# EAGLE design MicroMod_SAMD51 (EAGLE 9.5.2)
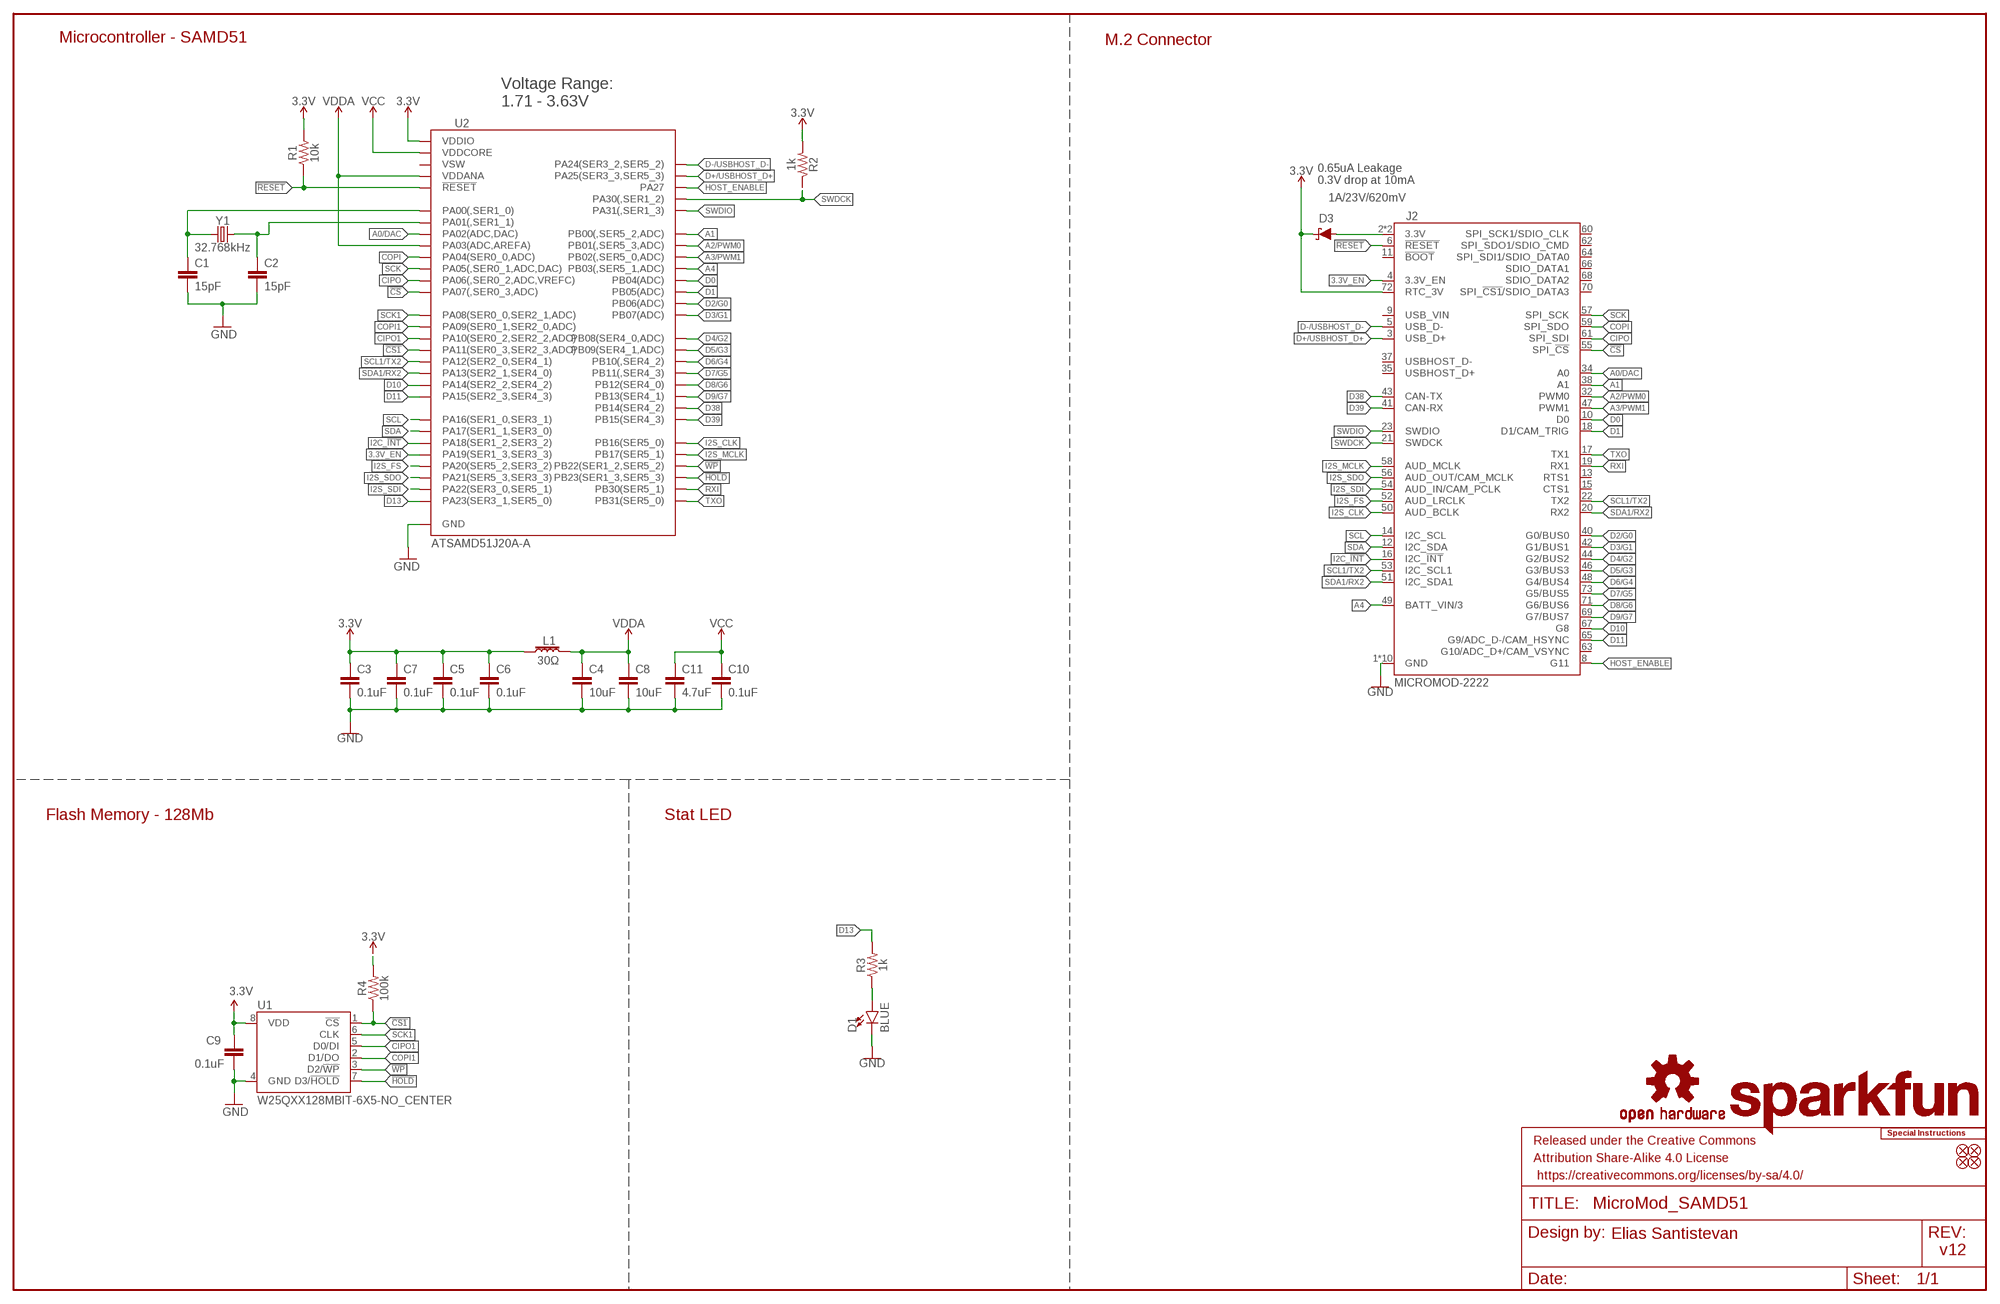
[diagram p0: schematic, sheet 1]

## Parts
C1  15pF  15PF-0402T-50V-5%  [0402-TIGHT]
C2  15pF  15PF-0402T-50V-5%  [0402-TIGHT]
C3  0.1uF  0.1UF-0402T-10V-10%-X7R  [0402-TIGHT]
C4  10uF  10UF-0402T-6.3V-20%  [0402-TIGHT]
C5  0.1uF  0.1UF-0402T-10V-10%-X7R  [0402-TIGHT]
C6  0.1uF  0.1UF-0402T-10V-10%-X7R  [0402-TIGHT]
C7  0.1uF  0.1UF-0402T-10V-10%-X7R  [0402-TIGHT]
C8  10uF  10UF-0402T-6.3V-20%  [0402-TIGHT]
C9  0.1uF  0.1UF-0402T-10V-10%-X7R  [0402-TIGHT]
C10  0.1uF  0.1UF-0402T-10V-10%-X7R  [0402-TIGHT]
C11  4.7uF  4.7UF-0402_TIGHT-6.3V-20%-X5R  [0402-TIGHT]
D1  BLUE  LED-BLUE0603  [LED-0603]
D3  1A/23V/620mV  DIODE-SCHOTTKY-BAT20J  [SOD-323]
FD5  FIDUCIALUFIDUCIAL  [FIDUCIAL-MICRO]
FD6  FIDUCIALUFIDUCIAL  [FIDUCIAL-MICRO]
FD7  FIDUCIALUFIDUCIAL  [FIDUCIAL-MICRO]
FD8  FIDUCIALUFIDUCIAL  [FIDUCIAL-MICRO]
FRAME2  FRAME-LEDGER  [CREATIVE_COMMONS]
J2  MICROMOD-2222  [M.2-CARD-E-22]
L1  30Ω  FERRITE_BEAD-0402-30OHM-100MHZ  [0402-TIGHT]
LOGO2  OSHW-LOGOMINI  [OSHW-LOGO-MINI]
LOGO5  SPECIAL_INSTRUCTIONS-ORDERING  [ORDERING_INSTRUCTIONS]
LOGO6  SFE_LOGO_NAME.1_INCH  [SFE_LOGO_NAME_.1]
R1  10k  10KOHM-0402T-1/16W-1%  [0402-TIGHT]
R2  1k  1KOHM-0402T-1/16W-1%  [0402-TIGHT]
R3  1k  1KOHM-0402T-1/16W-1%  [0402-TIGHT]
R4  100k  100KOHM-0402T-1/16W-1%  [0402-TIGHT]
U1  W25QXX128MBIT-6X5-NO_CENTER  [WSON-8-6X5-NO_CENTERPAD]
U2  ATSAMD51J20A-A  [TQFP64]
Y1  32.768kHz  CRYSTAL-32.768KHZSMD-3.2X1.5  [CRYSTAL-SMD-3.2X1.5MM]

## Nets
3.3V: C3.1 C5.1 C6.1 C7.1 C9.1 D3.C J2.72(RTC_3V) L1.1 R1.2 R2.2 R4.2 U1.8(VDD) U2.21(VDDIO) U2.34(VDDIO) U2.48(VDDIO) U2.56(VDDIO)
3.3V_EN: J2.4(3.3V_EN) U2.38(PA19(SER1_3,SER3_3))
3.3V_IN: D3.A J2.2(3.3V) J2.74(3.3V)
!CS: J2.55(SPI_!CS!) U2.16(PA07(,SER0_3,ADC))
!CS1!: R4.1 U1.1(!CS!) U2.20(PA11(SER0_3,SER2_3,ADC))
!HOLD!: U1.7(D3/!HOLD!) U2.50(PB23(SER1_3,SER5_3))
!RESET: J2.6(!RESET!) R1.1 U2.52(!RESET)
!WP!: U1.3(D2/!WP!) U2.49(PB22(SER1_2,SER5_2))
A0/DAC: J2.34(A0) U2.3(PA02(ADC,DAC))
A1: J2.38(A1) U2.61(PB00(,SER5_2,ADC))
A2/PWM0: J2.32(PWM0) U2.62(PB01(,SER5_3,ADC))
A3/PWM1: J2.47(PWM1) U2.63(PB02(,SER5_0,ADC))
A4: J2.49(BATT_VIN/3) U2.64(PB03(,SER5_1,ADC))
CIPO: J2.61(SPI_SDI) U2.15(PA06(,SER0_2,ADC,VREFC))
CIPO1: U1.5(D0/DI) U2.19(PA10(SER0_2,SER2_2,ADC))
COPI: J2.59(SPI_SDO) U2.13(PA04(SER0_0,ADC))
COPI1: U1.2(D1/DO) U2.18(PA09(SER0_1,SER2_0,ADC))
D0: J2.10(D0) U2.5(PB04(ADC))
D1: J2.18(D1/CAM_TRIG) U2.6(PB05(ADC))
D2/G0: J2.40(G0/BUS0) U2.9(PB06(ADC))
D3/G1: J2.42(G1/BUS1) U2.10(PB07(ADC))
D4/G2: J2.44(G2/BUS2) U2.11(PB08(SER4_0,ADC))
D5/G3: J2.46(G3/BUS3) U2.12(PB09(SER4_1,ADC))
D6/G4: J2.48(G4/BUS4) U2.23(PB10(,SER4_2))
D7/G5: J2.73(G5/BUS5) U2.24(PB11(,SER4_3))
D8/G6: J2.71(G6/BUS6) U2.25(PB12(SER4_0))
D9/G7: J2.69(G7/BUS7) U2.26(PB13(SER4_1))
D10: J2.67(G8) U2.31(PA14(SER2_2,SER4_2))
D11: J2.65(G9/ADC_D-/CAM_HSYNC) U2.32(PA15(SER2_3,SER4_3))
D13: R3.2 U2.44(PA23(SER3_1,SER5_0))
D38: J2.43(CAN-TX) U2.27(PB14(SER4_2))
D39: J2.41(CAN-RX) U2.28(PB15(SER4_3))
D+/USBHOST_D+ [USB]: J2.3(USB_D+) U2.46(PA25(SER3_3,SER5_3))
D-/USBHOST_D- [USB]: J2.5(USB_D-) U2.45(PA24(SER3_2,SER5_2))
GND: C1.2 C2.2 C3.2 C4.2 C5.2 C6.2 C7.2 C8.2 C9.2 C10.2 C11.2 D1.C J2.1(GND) J2.7(GND) J2.33(GND) J2.36(GND) J2.39(GND) J2.45(GND) J2.75(GND) J2.GND1(GND) J2.GND2(GND) J2.GND3(GND) U1.4(GND) U2.7(GND) U2.22(GND) U2.33(GND) U2.47(GND) U2.54(GND)
HOST_ENABLE: J2.8(G11) U2.51(PA27)
I2C_!INT!: J2.16(I2C_!INT!) U2.37(PA18(SER1_2,SER3_2))
I2S_CLK: J2.50(AUD_BCLK) U2.39(PB16(SER5_0))
I2S_FS: J2.52(AUD_LRCLK) U2.41(PA20(SER5_2,SER3_2))
I2S_MCLK: J2.58(AUD_MCLK) U2.40(PB17(SER5_1))
I2S_SDI: J2.54(AUD_IN/CAM_PCLK) U2.43(PA22(SER3_0,SER5_1))
I2S_SDO: J2.56(AUD_OUT/CAM_MCLK) U2.42(PA21(SER5_3,SER3_3))
N$1: D1.A R3.1
RXI: J2.19(RX1) U2.59(PB30(SER5_1))
SCK [Clock Signals]: J2.57(SPI_SCK) U2.14(PA05(,SER0_1,ADC,DAC))
SCK1 [Clock Signals]: U1.6(CLK) U2.17(PA08(SER0_0,SER2_1,ADC))
SCL: J2.14(I2C_SCL) U2.35(PA16(SER1_0,SER3_1))
SCL1/TX2: J2.22(TX2) J2.53(I2C_SCL1) U2.29(PA12(SER2_0,SER4_1))
SDA: J2.12(I2C_SDA) U2.36(PA17(SER1_1,SER3_0))
SDA1/RX2: J2.20(RX2) J2.51(I2C_SDA1) U2.30(PA13(SER2_1,SER4_0))
SWDCK: J2.21(SWDCK) R2.1 U2.57(PA30(,SER1_2))
SWDIO: J2.23(SWDIO) U2.58(PA31(,SER1_3))
TXO: J2.17(TX1) U2.60(PB31(SER5_0))
VCC: C10.1 C11.1 U2.53(VDDCORE)
VDDA: C4.1 C8.1 L1.2 U2.4(PA03(ADC,AREFA)) U2.8(VDDANA)
XIN32: C1.1 U2.1(PA00(,SER1_0)) Y1.P$1
XOUT32: C2.1 U2.2(PA01(,SER1_1)) Y1.P$2
Unconnected: J2.9(USB_VIN) J2.11(!BOOT!) J2.13(RTS1) J2.15(CTS1) J2.35(USBHOST_D+) J2.37(USBHOST_D-) J2.60(SPI_SCK1/SDIO_CLK) J2.62(SPI_SDO1/SDIO_CMD) J2.63(G10/ADC_D+/CAM_VSYNC) J2.64(SPI_SDI1/SDIO_DATA0) J2.66(SDIO_DATA1) J2.68(SDIO_DATA2) J2.70(SPI_!CS1!/SDIO_DATA3) U2.55(VSW)

## Notes on the sheet
- Microcontroller - SAMD51 | M.2 Connector
- Voltage Range:
  1.71 - 3.63V
- 0.65uA Leakage
  0.3V drop at 10mA
- Flash Memory - 128Mb | Stat LED
- Elias Santistevan
- v12

## Library data of the parts
C1 C2 = SparkFun-Capacitors:15PF: 15pF ceramic capacitors A capacitor is a passive two-terminal electrical component used to store electrical energy temporarily in an electric field.; PROD_ID: CAP-13063
C3 C5-C7 C9 C10 = SparkFun-Capacitors:0.1UF: 0.1µF ceramic capacitors A capacitor is a passive two-terminal electrical component used to store electrical energy temporarily in an electric field.; PROD_ID: CAP-15083
C4 C8 = SparkFun-Capacitors:10UF: 10.0µF ceramic capacitors A capacitor is a passive two-terminal electrical component used to store electrical energy temporarily in an electric field.; PROD_ID: CAP-14848
C11 = SparkFun-Capacitors:4.7UF: 4.7µF ceramic capacitors A capacitor is a passive two-terminal electrical component used to store electrical energy temporarily in an electric field.; PROD_ID: CAP-14240
D1 = SparkFun-LED:LED-BLUE: Blue SMD LED Used in manufacturing of various products at SparkFun Packages: 0603 - SMD 0603 package [Product Link] <http://www.digikey.com/product-detail/en/SMLE12BC7TT86/511-1589-2-ND/1641808> 1206 - SMD1206 package [Product Link] <http://www.digikey.com/product-detail/en/lite-on-inc/LTST-C150TBKT/160-1643-1-ND/573584> SparkFun Products: ESP8266 Thing-Dev Board <https://www.sparkfun.com/products/13711> RedBoard <https://www.sparkfun.com/products/12757>; PROD_ID: DIO-08575
D3 = SparkFun-DiscreteSemi:DIODE-SCHOTTKY: Schottky diode A Schottky diode is a semiconductor diode which has a low forward voltage drop and a very fast switching action.; PROD_ID: DIO-11623
FD5-FD8 = SparkFun-Aesthetics:FIDUCIAL: Fiducial Alignment Points Point-of-reference for pick-and-place machines and other optical instruments.
FRAME2 = SparkFun-Aesthetics:FRAME-LEDGER: Schematic Frame - Ledger Standard 11x14 US Ledger frame
J2 = SparkFun-MicroMod:MICROMOD: MicroMod Connector Description: A card edge connector and mating PCB connector to allow various MicroMod Processor Boards to be coupled with various carrier boards of different capabilities. Based on the M.2 standard.
L1 = SparkFun-Coils:FERRITE_BEAD: Ferrite Bead (blocks, cores, rings, chokes, etc.) Inductor with layers of ferrite used to suppress high frequencies. Often used to isolate high frequency noise. SparkFun Products: IOIO-OTG - V2.2 <https://www.sparkfun.com/products/13613> SparkFun SAMD21 Mini Breakout <https://www.sparkfun.com/products/13664> SparkFun 6 Degrees of Freedom Breakout - LSM6DS3 <https://www.sparkfun.com/products/13339> SparkFun SAMD21 Dev Breakout <https://www.sparkfun.com/products/13672>; PROD_ID: NDUC-15133
LOGO2 = SparkFun-Aesthetics:OSHW-LOGO: Open-Source Hardware (OSHW) Logo This logo indicates the piece of hardware it is found on incorporates a OSHW license and/or adheres to the definition of open source hardware found here: http://freedomdefined.org/OSHW
LOGO5 = SparkFun-Aesthetics:SPECIAL_INSTRUCTIONS: Special Ordering/Production Instructions Alert Symbol for special PCB ordering instructions or unique production process warnings. Ordering Instructions Production Instructions Types of information that should be added to box: Copper weight Soldermask color Silk color PCB thickness Number of layers PCB Standard: 1.6mm FR4 1 oz copper immersion silver plating red soldermask white silkscreen Types of information that should be added to box: Special wash requirements Depaneling instructions Humidification Glue curing Default text settings: 0.07 inch 9% ratio 50% line distance
LOGO6 = SparkFun-Aesthetics:SFE_LOGO_NAME: SparkFun Font Logo This is the SparkFun name logo. The logo on the schematic will always be the same size; the package variant is the height of the flame part of the logo (or the height the flame would be, if it were drawn). Default layer for the logo on the board is tSilk.
R1 = SparkFun-Resistors:10KOHM: 10kΩ resistor A resistor is a passive two-terminal electrical component that implements electrical resistance as a circuit element. Resistors act to reduce current flow, and, at the same time, act to lower voltage levels within circuits. - Wikipedia; PROD_ID: RES-14241
R2 R3 = SparkFun-Resistors:1KOHM: 1kΩ resistor A resistor is a passive two-terminal electrical component that implements electrical resistance as a circuit element. Resistors act to reduce current flow, and, at the same time, act to lower voltage levels within circuits. - Wikipedia; PROD_ID: RES-14342
R4 = SparkFun-Resistors:100KOHM: 100kΩ resistor A resistor is a passive two-terminal electrical component that implements electrical resistance as a circuit element. Resistors act to reduce current flow, and, at the same time, act to lower voltage levels within circuits. - Wikipedia; PROD_ID: RES-13495
U1 = SparkFun-MicroMod:W25QXX; PROD_ID: IC-15107
U2 = SparkFun-IC-Microcontroller:ATSAMD51J20A-A; PROD_ID: IC-13952
Y1 = SparkFun-Clocks:CRYSTAL-32.768KHZ: 32.768kHz Crystal Frequency: 32.768kHz Frequency Stability: ±20ppm Load Capacitance: 12.5pF (PTH-2X6 & SMD-3.2X1.5), 6pF (SMD-2X6) SparkFun Products: SparkFun BigTime Watch Kit <https://www.sparkfun.com/products/11734> SparkFun nRF52832 Breakout <https://www.sparkfun.com/products/13990> SparkFun Real Time Clock Module <https://www.sparkfun.com/products/12708>; PROD_ID: XTAL-13062

## Net classes
0 default: width 0 mm, drill 0 mm
1 Clock Signals: clearance 0.203 mm
2 USB: width 0.102 mm, clearance 0.076 mm

## Board
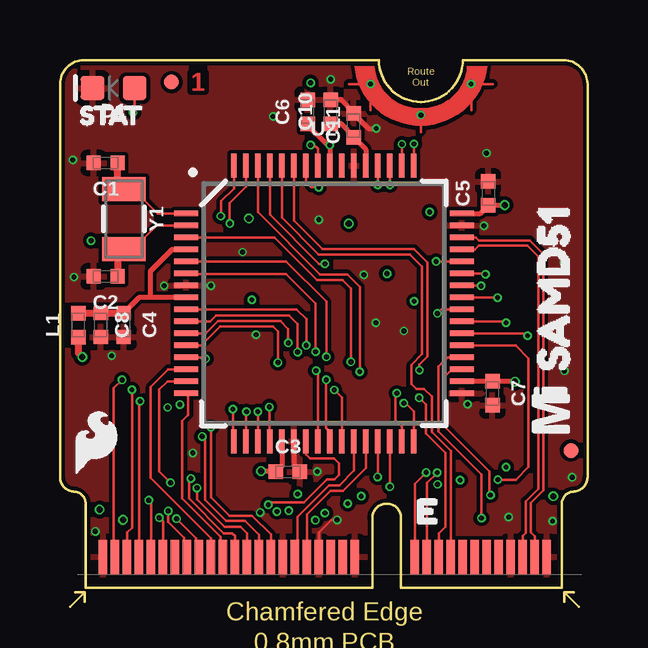
[diagram p1: board, top side]
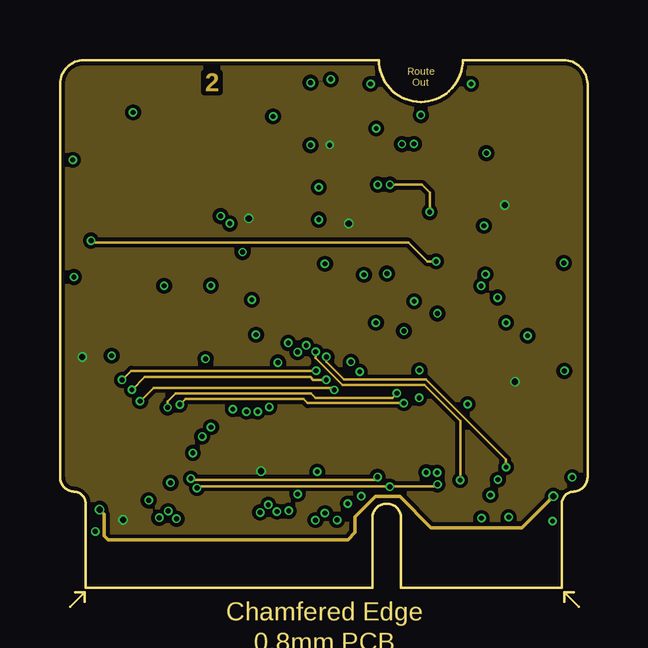
[diagram p2: board, inner layer PWR_HORIZ]
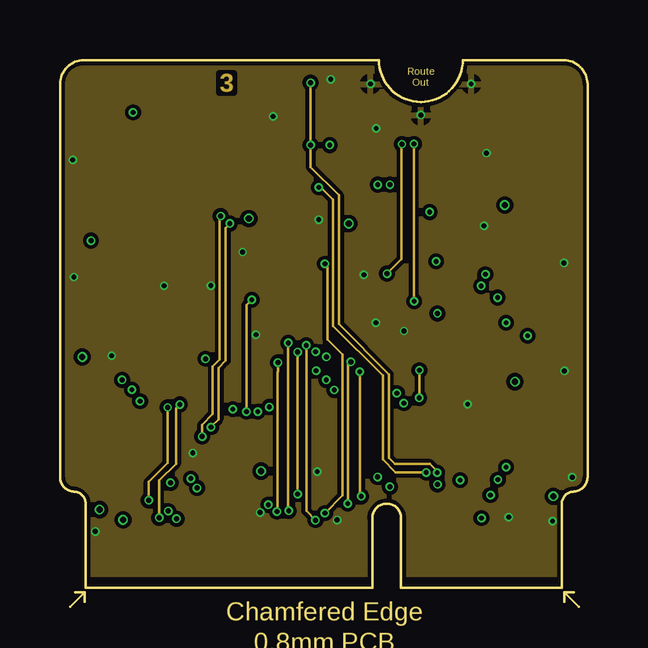
[diagram p3: board, inner layer GND-VERT]
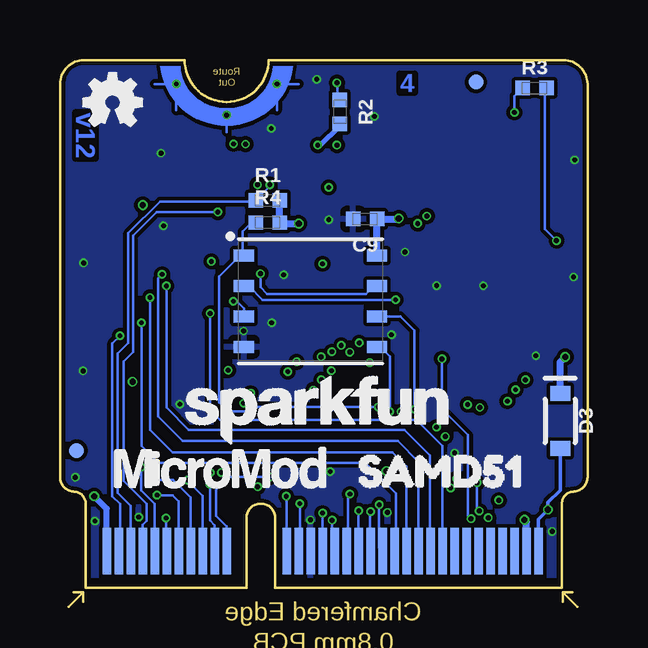
[diagram p4: board, bottom side, seen from below]

Size 22 x 22 mm. Coordinates in mm from the lower left corner, seen from the top.
Outline: 0,4.6 0,21 arc-87 1,22 13.3,22 arc90 15.05,20.25 arc90 16.8,22 21,22 arc-87 22,21 22,4.6
Outline: 0,4.6 arc87 0.6,4
Outline: 21.4,4 arc87 22,4.6
Outline: 21.4,4 arc85 20.93,3.5 20.93,0 14.22,0 14.22,2.9 arc180 13.03,2.9 13.03,0 1.07,0 1.07,3.5 arc84 0.6,4
Outline: 21.4,4 arc87 22,4.6
Outline: 0,4.6 arc87 0.6,4
Copper layers (1+2*15+16): Top 0.035mm / dielectric 1.5mm / PWR_HORIZ 0.035mm / dielectric 0.15mm / GND-VERT 0.035mm / dielectric 0.2mm / Bottom 0.035mm
Design rules "SparkFun-4-layer-MicroMod": minimum track width 4mil, minimum drill 0.2mm, track to track 4mil, track to pad 4mil, pad to pad 4mil, via to via 4mil, smd to smd 4mil, copper to edge 6mil, drill to drill 6mil, minimum pad ring 3mil, minimum via ring 3mil, stop-mask expansion 4mil, vias tented up to drill 25mil, thermal gap 10mil

### Footprints (pad centres in the part's own frame; a part is rotated, then mirrored left to right if it is on the bottom)
0402-TIGHT = smd 0.6 x 0.6: 1 -0.5,0; 2 0.5,0
LED-0603 = smd 1 x 1: A -0.877,0; C 0.877,0
SOD-323 = smd 0.63 x 0.83: A 1.15,0; C -1.15,0
FIDUCIAL-MICRO = smd 0.635 x 0.635: 1 0,0
M.2-CARD-E-22 = smd 0.35 x 1.45: 1 9.25,1.275; 3 8.75,1.275; 5 8.25,1.275; 7 7.75,1.275; 9 7.25,1.275; 11 6.75,1.275; 13 6.25,1.275; 15 5.75,1.275; 17 5.25,1.275; 19 4.75,1.275; 21 4.25,1.275; 23 3.75,1.275; 33 1.25,1.275; 35 0.75,1.275; 37 0.25,1.275; 39 -0.25,1.275; 41 -0.75,1.275; 43 -1.25,1.275; 45 -1.75,1.275; 47 -2.25,1.275; 49 -2.75,1.275; 51 -3.25,1.275; 53 -3.75,1.275; 55 -4.25,1.275; 57 -4.75,1.275; 59 -5.25,1.275; 61 -5.75,1.275; 63 -6.25,1.275; 65 -6.75,1.275; 67 -7.25,1.275; 69 -7.75,1.275; 71 -8.25,1.275; 73 -8.75,1.275; 75 -9.25,1.275 | smd 0.35 x 1.95 bottom: 2 9,1.525; 4 8.5,1.525; 6 8,1.525; 8 7.5,1.525; 10 7,1.525; 12 6.5,1.525; 14 6,1.525; 16 5.5,1.525; 18 5,1.525; 20 4.5,1.525; 22 4,1.525; 32 1.5,1.525; 34 1,1.525; 36 0.5,1.525; 38 0,1.525; 40 -0.5,1.525; 42 -1,1.525; 44 -1.5,1.525; 46 -2,1.525; 48 -2.5,1.525; 50 -3,1.525; 52 -3.5,1.525; 54 -4,1.525; 56 -4.5,1.525; 58 -5,1.525; 60 -5.5,1.525; 62 -6,1.525; 64 -6.5,1.525; 66 -7,1.525; 68 -7.5,1.525; 70 -8,1.525; 72 -8.5,1.525; 74 -9,1.525 | drill 0.2: GND1 1.9,21; GND2 4,19.7; GND3 6.1,21
WSON-8-6X5-NO_CENTERPAD = smd 0.85 x 0.5: 1 -2.775,1.905; 2 -2.775,0.635; 3 -2.775,-0.635; 4 -2.775,-1.905; 5 2.775,-1.905; 6 2.775,-0.635; 7 2.775,0.635; 8 2.775,1.905
TQFP64 = smd 0.22 x 1: 1 -3.75,-5.75; 2 -3.25,-5.75; 3 -2.75,-5.75; 4 -2.25,-5.75; 5 -1.75,-5.75; 6 -1.25,-5.75; 7 -0.75,-5.75; 8 -0.25,-5.75; 9 0.25,-5.75; 10 0.75,-5.75; 11 1.25,-5.75; 12 1.75,-5.75; 13 2.25,-5.75; 14 2.75,-5.75; 15 3.25,-5.75; 16 3.75,-5.75; 33 3.75,5.75; 34 3.25,5.75; 35 2.75,5.75; 36 2.25,5.75; 37 1.75,5.75; 38 1.25,5.75; 39 0.75,5.75; 40 0.25,5.75; 41 -0.25,5.75; 42 -0.75,5.75; 43 -1.25,5.75; 44 -1.75,5.75; 45 -2.25,5.75; 46 -2.75,5.75; 47 -3.25,5.75; 48 -3.75,5.75 | smd 1 x 0.22: 17 5.75,-3.75; 18 5.75,-3.25; 19 5.75,-2.75; 20 5.75,-2.25; 21 5.75,-1.75; 22 5.75,-1.25; 23 5.75,-0.75; 24 5.75,-0.25; 25 5.75,0.25; 26 5.75,0.75; 27 5.75,1.25; 28 5.75,1.75; 29 5.75,2.25; 30 5.75,2.75; 31 5.75,3.25; 32 5.75,3.75; 49 -5.75,3.75; 50 -5.75,3.25; 51 -5.75,2.75; 52 -5.75,2.25; 53 -5.75,1.75; 54 -5.75,1.25; 55 -5.75,0.75; 56 -5.75,0.25; 57 -5.75,-0.25; 58 -5.75,-0.75; 59 -5.75,-1.25; 60 -5.75,-1.75; 61 -5.75,-2.25; 62 -5.75,-2.75; 63 -5.75,-3.25; 64 -5.75,-3.75
CRYSTAL-SMD-3.2X1.5MM = smd 1 x 1.8: P$1 -1.25,0; P$2 1.25,0

### Placement (x,y rotation side)
C1  1.91,17.71 180 top
C2  1.91,12.98 180 top
C3  9.51,4.83 0 top
C4  2.66,10.95 270 top
C5  17.86,16.43 90 top
C6  10.33,19.84 90 top
C7  18.04,8.1 270 top
C8  1.71,10.95 270 top
C9  9.27,15.37 180 bottom
C10  11.28,19.84 90 top
C11  12.25,19.27 90 top
D1  2.24,20.83 180 top
D3  1.14,6.95 270 bottom
FD5  4.65,21.08 0 top
FD6  4.65,21.08 0 bottom
FD7  21.31,5.71 0 bottom
FD8  21.31,5.71 0 top
FRAME2  -7.62,-13.97 0 top  (outside the outline)
J2  11.05,0 0 top
L1  0.77,10.94 90 top
LOGO2  19.8,20.24 0 bottom
LOGO5  30.48,50.8 0 top  (outside the outline)
LOGO6  11.26,7.4 0 bottom
R1  13.34,16.14 0 bottom
R2  10.33,19.84 270 bottom
R3  2.21,20.83 0 bottom
R4  13.34,15.22 0 bottom
U1  11.56,11.94 0 bottom
U2  11,11.85 270 top
U$1  [MICROMOD_MI_LOGO_.35]  20.45,7.37 90 top
U$4  [MICROMOD_LOGO_.35]  15.37,4.95 0 bottom
U$5  [SAMD510]  10.72,4.86 0 bottom
U$6  [SAMD510]  20.57,7.87 90 top
U$7  [SFE_LOGO_FLAME_.1]  1.5,6.07 0 top
U$8  [STAT0]  0.13,19.68 0 top
Y1  2.67,15.37 270 top

### Tracks (layer width: path | path; a pad name or v marks a point on that pad's centre or on a via)
3.3V  (via drill 0.2, 0.25)
  Top 0.203: v18.98,8.58 18.96,8.6 C7.1 U2.34 | U2.21 9.25,5.07 C3.1 8.98,4.85 v8.39,4.85 | v18.55,15.95 18.53,15.93 C5.1 17.52,15.6 U2.48 | U2.56 v11.25,18.45 11.23,18.47 11.13,18.47 10.33,19.27 R2.2
  Top 0.3: L1.1 0.77,9.78 v0.94,9.61
  Bottom 0.203: R2.2 10.33,19.27 11.15,18.45 v11.25,18.45
  Bottom 0.3: U1.8 8.78,15.36 C9.1 7.9,15.37 v7.87,15.39 | R1.2 R4.2 12.8,15.18 v12.04,15.18 | J2.72 2.55,2.74 v2.63,2.82 | D3.C 1.14,9.4 v0.94,9.61
  pour PWR_HORIZ (isolate 0.152): -0.01,20.85 arc-90 1.12,21.97 21.06,21.97 arc-90 22,21.03 22,0.56 0.04,0.56 0.04,4.19
3.3V_EN  (via drill 0.2)
  Top 0.102: v19.5,10.5 19.4,10.6 U2.38
  Bottom 0.102: J2.4 19.5,1.57 19.5,3.48 19.82,3.8 19.82,10.18 v19.5,10.5
3.3V_IN  (via drill 0.25)
  PWR_HORIZ 0.15: v1.65,3.25 1.85,3.05 1.85,2.15 2,2 12,2 12.3,2.3 12.3,2.95 13.15,3.8 14.17,3.8 15.48,2.49 19.25,2.49 v20.57,3.81
  Bottom 0.15: J2.74 2.05,2.85 v1.65,3.25 1.65,3.55 1.14,4.06 D3.A
  Bottom 0.254: J2.2 20.05,3.29 v20.57,3.81
!CS
  Top 0.102: U2.16 5.35,8.1 5.35,7.2 5.33,7.18 5.09,6.94 5.09,3.71 6.69,2.11 6.69,1.39 J2.55
!CS1!  (via drill 0.2)
  Top 0.102: v8.73,7.53 8.73,6.12 U2.20
  Bottom 0.102: U1.1 14.49,13.84 15.36,12.97 15.36,7.72 14.99,7.35 13.96,7.35 13.78,7.53 v8.73,7.53
  Bottom 0.114: U1.1 14.38,13.89 14.38,14.85 14.02,15.22 R4.1
!HOLD!  (via drill 0.2)
  Top 0.102: U2.50 v14.25,18.48 v14.26,18.49
  GND-VERT 0.102: v13.64,13.09 14.24,13.69 14.24,18.47 v14.26,18.49
  Bottom 0.102: U1.7 8.93,12.57 9.25,12.25 13.36,12.25 13.64,12.53 v13.64,13.09
!RESET  (via drill 0.2)
  Top 0.102: U2.52 v13.25,16.8
  Bottom 0.102: J2.6 19.05,3.41 19.59,3.95 19.59,9.75 19.15,10.19 19.15,14.77 17.83,16.09 13.88,16.09 R1.1 13.84,16.16 13.25,16.75 v13.25,16.8
!WP!  (via drill 0.2)
  Top 0.102: U2.49 v14.75,18.49 v14.76,18.5
  GND-VERT 0.102: v14.76,18.5 v14.77,18.49 v14.77,11.94
  Bottom 0.102: U1.3 14.33,11.64 14.63,11.94 v14.77,11.94
A0/DAC  (via drill 0.2)
  Top 0.102: U2.3 8.95,14.59 10.72,12.82 11.78,12.82 12.13,12.47 v12.13,9.41
  GND-VERT 0.102: v12.13,9.41 12,9.28 v12,3.5
  Bottom 0.102: J2.34 12,1.57 v12,3.5
A1  (via drill 0.2)
  Top 0.102: U2.61 8.75,15.55 10.8,13.5 v11.05,13.5
  GND-VERT 0.102: v11.05,13.5 11.16,13.39 11.16,10.35 11.79,9.72 11.79,3.84 v11.05,3.1
  Bottom 0.102: J2.38 v11.05,3.1
A2/PWM0  (via drill 0.2)
  Top 0.102: U2.62 8.25,15.65 10.85,13.05 11.99,13.05 12.5,12.54 v12.5,9
  GND-VERT 0.102: v12.5,9 12.5,3.87 v12.56,3.81
  Bottom 0.102: J2.32 12.55,3.74 12.59,3.78 v12.56,3.81
A3/PWM1  (via drill 0.2)
  Top 0.102: v7.08,15.18 7.08,16.04 7.75,16.71 U2.63 | J2.47 8.8,2.21 8.02,2.99 7.08,2.99 6.3,3.77 v6.3,6.69
  GND-VERT 0.102: v7.08,15.18 v7.08,15.17 6.91,15 6.91,9.46 6.61,9.16 6.61,7.02 6.3,6.71 v6.3,6.69
A4  (via drill 0.2)
  Top 0.102: U2.64 7.25,16.64 6.72,16.11 6.72,15.51 v6.7,15.49 | J2.49 8.3,2.2 7.72,2.78 6.92,2.78 6.05,3.65 6.05,6.18 v5.93,6.3
  GND-VERT 0.102: v6.7,15.49 6.66,15.45 6.66,9.51 6.37,9.22 6.37,7.23 5.93,6.79 v5.93,6.3
CIPO  (via drill 0.2)
  Top 0.102: v4.61,4.37 4.14,4.84 4.14,8.25 4.49,8.6 U2.15 | J2.61 5.18,1.4 5.18,2.08 4.51,2.74 v4.51,3.19
  Bottom 0.102: v4.51,3.19 4.61,3.29 v4.61,4.37
CIPO1  (via drill 0.2)
  Top 0.102: U2.19 v8.25,7.33
  Bottom 0.102: v8.25,7.33 8.25,9.64 8.64,10.03 U1.5
COPI  (via drill 0.2)
  Top 0.102: U2.13 6,9.6 v6.07,9.54 | J2.59 5.67,1.41 5.67,2.06 v4.86,2.87
  Bottom 0.102: v6.07,9.54 6.07,7.45 4.98,6.36 4.98,2.99 v4.86,2.87
COPI1  (via drill 0.2)
  Top 0.102: U2.18 7.75,7.3 v7.78,7.33
  GND-VERT 0.102: v7.78,7.33 7.78,11.78 v8,12
  Bottom 0.102: U1.2 14.12,12.57 13.55,12 v8,12
D0  (via drill 0.2)
  Top 0.102: v11.11,9.62 11.11,11.92 9.43,13.6 U2.5
  PWR_HORIZ 0.102: v11.11,9.62 11.11,9.41 11.85,8.67 15.27,8.67 18.6,5.34 v18.6,5.02
  Bottom 0.102: J2.10 18.05,3.48 18.62,4.05 18.62,5 v18.6,5.02
D1  (via drill 0.2)
  Top 0.102: U2.6 5.27,13.08 9.42,13.08 10.66,11.84 v10.66,9.83
  PWR_HORIZ 0.102: v10.66,9.83 10.66,9.57 11.78,8.45 15.19,8.45 16.69,6.95 v16.69,4.48
  Bottom 0.102: J2.18 16.05,3.82 16.69,4.46 v16.69,4.48
D2/G0  (via drill 0.2)
  Top 0.102: U2.9 9.87,11.6 10.27,11.2 v10.27,10.1
  GND-VERT 0.102: v10.27,10.1 10.27,3.19 v10.65,2.81
  Bottom 0.102: v10.65,2.81 10.65,1.63 J2.40
D3/G1  (via drill 0.2)
  Top 0.102: U2.10 6.25,11.1 6.5,11.35 9.55,11.35 9.91,10.99 v9.91,9.82
  GND-VERT 0.102: v9.91,9.82 9.91,3.96 v9.91,3.89
  Bottom 0.102: v9.91,3.89 10,3.8 10,1.57 J2.42
D4/G2  (via drill 0.2)
  Top 0.102: U2.11 6.07,10.6 6.59,11.12 9.19,11.12 9.52,10.79 v9.52,10.2
  GND-VERT 0.102: v9.52,10.2 9.52,3.22 v9.54,3.2
  Bottom 0.102: v9.54,3.2 v9.55,3.19 J2.44
D5/G3  (via drill 0.2)
  Top 0.102: U2.12 5.89,10.1 6.67,10.88 8.89,10.88 9.09,10.68 v9.09,9.38
  GND-VERT 0.102: v9.05,3.17 9.08,3.17 9.08,9 9.09,9.01 v9.09,9.38
  Bottom 0.102: J2.46 9.07,1.55 9.07,3.15 v9.05,3.17
D6/G4  (via drill 0.2)
  Top 0.102: v8.69,3.45 8.79,3.55 10.17,3.55 11.13,4.51 11.45,4.51 11.64,4.7 11.64,5.17 11.43,5.38 10.43,5.38 10.25,5.56 U2.23
  Bottom 0.102: v8.69,3.45 8.69,1.67 J2.48
D7/G5  (via drill 0.2)
  Top 0.102: v10.68,9.04 10.75,8.97 U2.24 | J2.73 2.25,1.32 2.25,8.32 v2.59,8.66
  PWR_HORIZ 0.102: v2.59,8.66 2.97,9.04 v10.68,9.04
D8/G6  (via drill 0.2)
  Top 0.102: v11.1,8.66 11.1,6.66 11.25,6.51 U2.25 | J2.71 2.8,2.3 3,2.5 v3,8.25
  PWR_HORIZ 0.102: v3,8.25 3.53,8.78 10.44,8.78 10.56,8.66 v11.1,8.66
D9/G7  (via drill 0.2)
  Top 0.102: U2.26 11.75,7.93 v11.44,8.24 | J2.69 3.3,7.73 v3.34,7.77
  PWR_HORIZ 0.102: v11.44,8.24 11.35,8.33 3.9,8.33 v3.34,7.77
D10  (via drill 0.2)
  Top 0.102: v14.05,8.1 13.98,8.03 13.98,6.96 14.25,6.69 U2.31 | J2.67 3.8,3.54 v3.7,3.64
  PWR_HORIZ 0.102: v14.05,8.1 13.86,7.91 10.65,7.91 10.46,8.1 4.82,8.1 4.49,7.77 v4.49,7.51
  GND-VERT 0.102: v3.7,3.64 3.7,4.41 4.49,5.2 v4.49,7.51
D11  (via drill 0.2)
  Top 0.102: U2.32 14.76,7.34 14.41,7.69 v14.34,7.69 | J2.65 4.3,2.75 v4.14,2.91
  PWR_HORIZ 0.102: v14.34,7.69 10.33,7.69 10.15,7.87 5.24,7.87 v5,7.63
  GND-VERT 0.102: v4.14,2.91 4.14,4.46 4.84,5.16 4.84,7.47 v5,7.63
D13  (via drill 0.2)
  Top 0.102: U2.44 v15.69,13.6
  PWR_HORIZ 0.102: v1.3,14.47 1.39,14.38 14.54,14.38 15.31,13.6 v15.69,13.6
  Bottom 0.102: R3.2 1.78,20.76 1.78,14.95 v1.3,14.47
D38
  Top 0.102: J2.43 9.9,1.38 9.9,2.94 11.23,4.27 11.65,4.27 12.26,4.88 U2.27
D39
  Top 0.102: J2.41 10.3,3.05 11.29,4.04 11.8,4.04 12.75,4.99 U2.28
D+/USBHOST_D+
  Top 0.102: U2.46 17.34,14.6 17.46,14.47 19.58,14.47 20.16,13.9 20.16,4.04 19.63,3.52 19.63,2.3 19.8,2.13 J2.3
D-/USBHOST_D-
  Top 0.102: U2.45 17.3,14.1 17.46,14.27 19.49,14.27 19.94,13.81 19.94,4.12 19.43,3.6 19.43,2.29 19.3,2.16 J2.5
GND  (via drill 0.2)
  Top 0.102: J2.39 10.8,2.3 11.32,2.82 v11.56,2.82
  Top 0.203: U2.22 9.75,5.08 C3.2 | 12.25,19.82 11.73,20.34 C10.2 | C11.2 12.87,19.14 v13.19,19.14
  other vias: 14.34,10.7 10.79,15.34 10.73,4.83 6.29,12.59 2.16,9.67 0.59,12.95 0.53,17.83 18.71,2.94 4.34,12.58 17,7.64 17.68,15.08 8.89,19.64 17.79,18.11 1.47,2.34 21.36,4.6 20.54,2.77 8.35,3.13 21.02,13.53 21.04,9.03 11.29,21.19 8.18,10.54 13.18,11.04 12.68,13.04 7.62,13.99 5.55,5.61
  pour Top (isolate 0.152): -0.01,20.85 arc-90 1.12,21.97 21.06,21.97 arc-90 22,21.03 22,0.53 0.04,0.53 0.04,4.19
  pour Bottom (isolate 0.152): -0.01,20.85 arc-90 1.12,21.97 21.06,21.97 arc-90 22,21.03 22,0.53 0.04,0.53 0.04,4.19
  pour GND-VERT (isolate 0.152): -0.01,20.85 arc-90 1.12,21.97 21.06,21.97 arc-90 22,21.03 22,0.56 0.04,0.56 0.04,4.19
HOST_ENABLE  (via drill 0.2)
  Top 0.102: U2.51 v13.75,16.81 v13.76,16.8
  PWR_HORIZ 0.102: v13.76,16.8 15.09,16.8 15.42,16.47 v15.42,15.66
  Bottom 0.102: J2.8 18.55,2.62 18.38,2.79 18.38,3.49 19.34,4.45 19.34,9.43 18.94,9.83 18.94,14.68 17.96,15.66 v15.42,15.66
I2C_!INT!  (via drill 0.2)
  Top 0.102: U2.37 19,10.1 19.54,9.56 19.54,5.04 19,4.5 v18.26,4.5
  Bottom 0.102: J2.16 16.55,3.76 17.29,4.5 v18.26,4.5
I2S_CLK  (via drill 0.2)
  Top 0.102: v18.6,11.04 18.54,11.1 U2.39
  Bottom 0.102: J2.50 8,1.57 8,3.92 9.27,5.19 17.88,5.19 18.6,5.91 v18.6,11.04
I2S_FS  (via drill 0.2)
  Top 0.102: v18.25,12.09 U2.41
  Bottom 0.102: J2.52 7.55,5.06 8.13,5.64 17.31,5.64 18.24,6.57 v18.24,12.08 v18.25,12.09
I2S_MCLK  (via drill 0.2)
  Top 0.102: v15.74,11.43 15.91,11.6 U2.40
  Bottom 0.102: J2.58 6.05,5.91 7.14,7 15.33,7 15.74,7.41 v15.74,11.43
I2S_SDI  (via drill 0.2)
  Top 0.102: U2.43 17.71,13.1 v17.74,13.06
  Bottom 0.102: J2.54 7.05,5.25 7.92,6.11 16.88,6.11 17.91,7.14 17.91,12.88 17.74,13.04 v17.74,13.06
I2S_SDO  (via drill 0.2)
  Top 0.102: U2.42 17.54,12.6 v17.56,12.57
  Bottom 0.102: J2.56 6.57,1.55 6.57,5.51 7.64,6.58 16.63,6.58 17.56,7.51 v17.56,12.57
N$1  (via drill 0.2)
  Top 0.102: D1.A 3.11,20.13 3.05,20.07 v3.05,19.81
  Bottom 0.102: R3.1 3.05,20.49 v3.05,19.81
RXI  (via drill 0.2)
  Top 0.102: J2.19 15.8,2.26 16.07,2.53 16.07,5.62 15.26,6.43 15.26,7.63 v14.98,7.91 | U2.59 9.75,15.31 10.95,14.11 14.77,14.11 15.32,13.56 15.32,9.64 14.99,9.31 v14.99,9.06
  GND-VERT 0.102: v14.99,9.06 v14.98,9.05 v14.98,7.91
SCK
  Top 0.102: U2.14 4.52,9.1 3.79,8.37 3.79,4.56 6.3,2.05 J2.57
SCK1  (via drill 0.2)
  Top 0.102: U2.17 7.21,6.14 v7.21,7.44
  Bottom 0.102: U1.6 7.8,11.3 7.21,10.71 v7.21,7.44
SCL  (via drill 0.2)
  Top 0.102: v17.95,3.85 17.9,3.85 17.9,4.85 15.99,6.76 15.99,8.74 16.35,9.1 U2.35
  Bottom 0.102: J2.14 17.05,3.6 17.3,3.85 v17.95,3.85
SCL1/TX2  (via drill 0.2)
  Top 0.102: v5.46,4.55 5.38,4.47 5.38,3.71 6.82,2.27 7.18,2.27 7.3,2.15 J2.53 | v13.24,4.61 v13.25,4.62 U2.29
  PWR_HORIZ 0.102: v13.24,4.61 13.12,4.49 5.51,4.49 v5.46,4.55
  Bottom 0.102: J2.22 15.05,2.55 15.5,3 15.5,4.08 14.97,4.61 v13.24,4.61
SDA  (via drill 0.2)
  Top 0.102: v17.58,2.9 17.58,4.72 15.78,6.52 15.78,9.21 16.17,9.6 U2.36
  Bottom 0.102: v17.58,2.9 17.58,1.55 J2.12
SDA1/RX2  (via drill 0.2)
  Top 0.102: U2.30 v13.75,4.21 v13.76,4.2 | J2.51 7.8,2.26 7.53,2.53 6.86,2.53 5.72,3.67 v5.72,4.15
  PWR_HORIZ 0.102: v5.72,4.15 5.79,4.22 13.74,4.22 v13.76,4.2 13.77,4.21 15.65,4.21 v15.74,4.3
  Bottom 0.102: J2.20 15.55,2.6 15.74,2.79 v15.74,4.3
SWDCK  (via drill 0.2)
  Top 0.102: J2.21 15.3,4.36 v15.73,4.79 | v15.73,4.79
  Top 0.114: U2.57 10.75,18.3 10.6,18.45 v10.45,18.45
  GND-VERT 0.102: v15.73,4.79 15.73,4.85 15.43,5.15 13.98,5.15 13.72,5.41 13.72,8.89 11.62,10.98 11.62,16.36 10.45,17.54 v10.45,18.45 v10.45,21.05
  Bottom 0.102: v10.45,21.05 10.43,21.03 10.43,20.44 R2.1
SWDIO  (via drill 0.2)
  Top 0.102: J2.23 14.8,4.33 v15.27,4.8 | U2.58 10.25,16.9 10.46,16.69 v10.79,16.69
  GND-VERT 0.102: v15.27,4.8 14,4.8 13.46,5.33 13.46,8.84 11.39,10.91 11.39,16.17 10.87,16.69 v10.79,16.69
TXO
  Top 0.102: U2.60 9.25,15.43 10.79,13.89 14.59,13.89 15.1,13.38 15.1,9.73 14.66,9.29 14.66,8.49 14.87,8.28 15.18,8.28 15.5,7.96 15.5,6.5 16.3,5.7 J2.17
VCC
  Top 0.203: U2.53 12.75,18.27 C11.1 12.25,18.82 11.73,19.34 C10.1
VDDA
  Top 0.203: U2.4 4.68,14.1 3.77,13.19 3.77,12.12 3.75,12.1 | U2.8 3.75,12.1 | 3.75,12.1 3.31,12.1 C4.1
  Top 0.3: L1.2 C8.1 C4.1
XIN32
  Top 0.102: Y1.P$1 3.05,16.62 4.07,15.6 U2.1
  Top 0.3: Y1.P$1 2.4,16.88 C1.1
XOUT32
  Top 0.102: Y1.P$2 3.05,14.12 4.03,15.1 U2.2
  Top 0.3: Y1.P$2 2.4,13.86 C2.1

### Text on the board
Top: 1
PWR_HORIZ: 2
GND-VERT: 3
Bottom: 4 | v12
tDocu: 0.8mm PCB / 45 degree chamfered edge / Four layer design / ENIG Finish | Elias Santistevan